# EAGLE board 005743-001 (EAGLE 6.6.0)
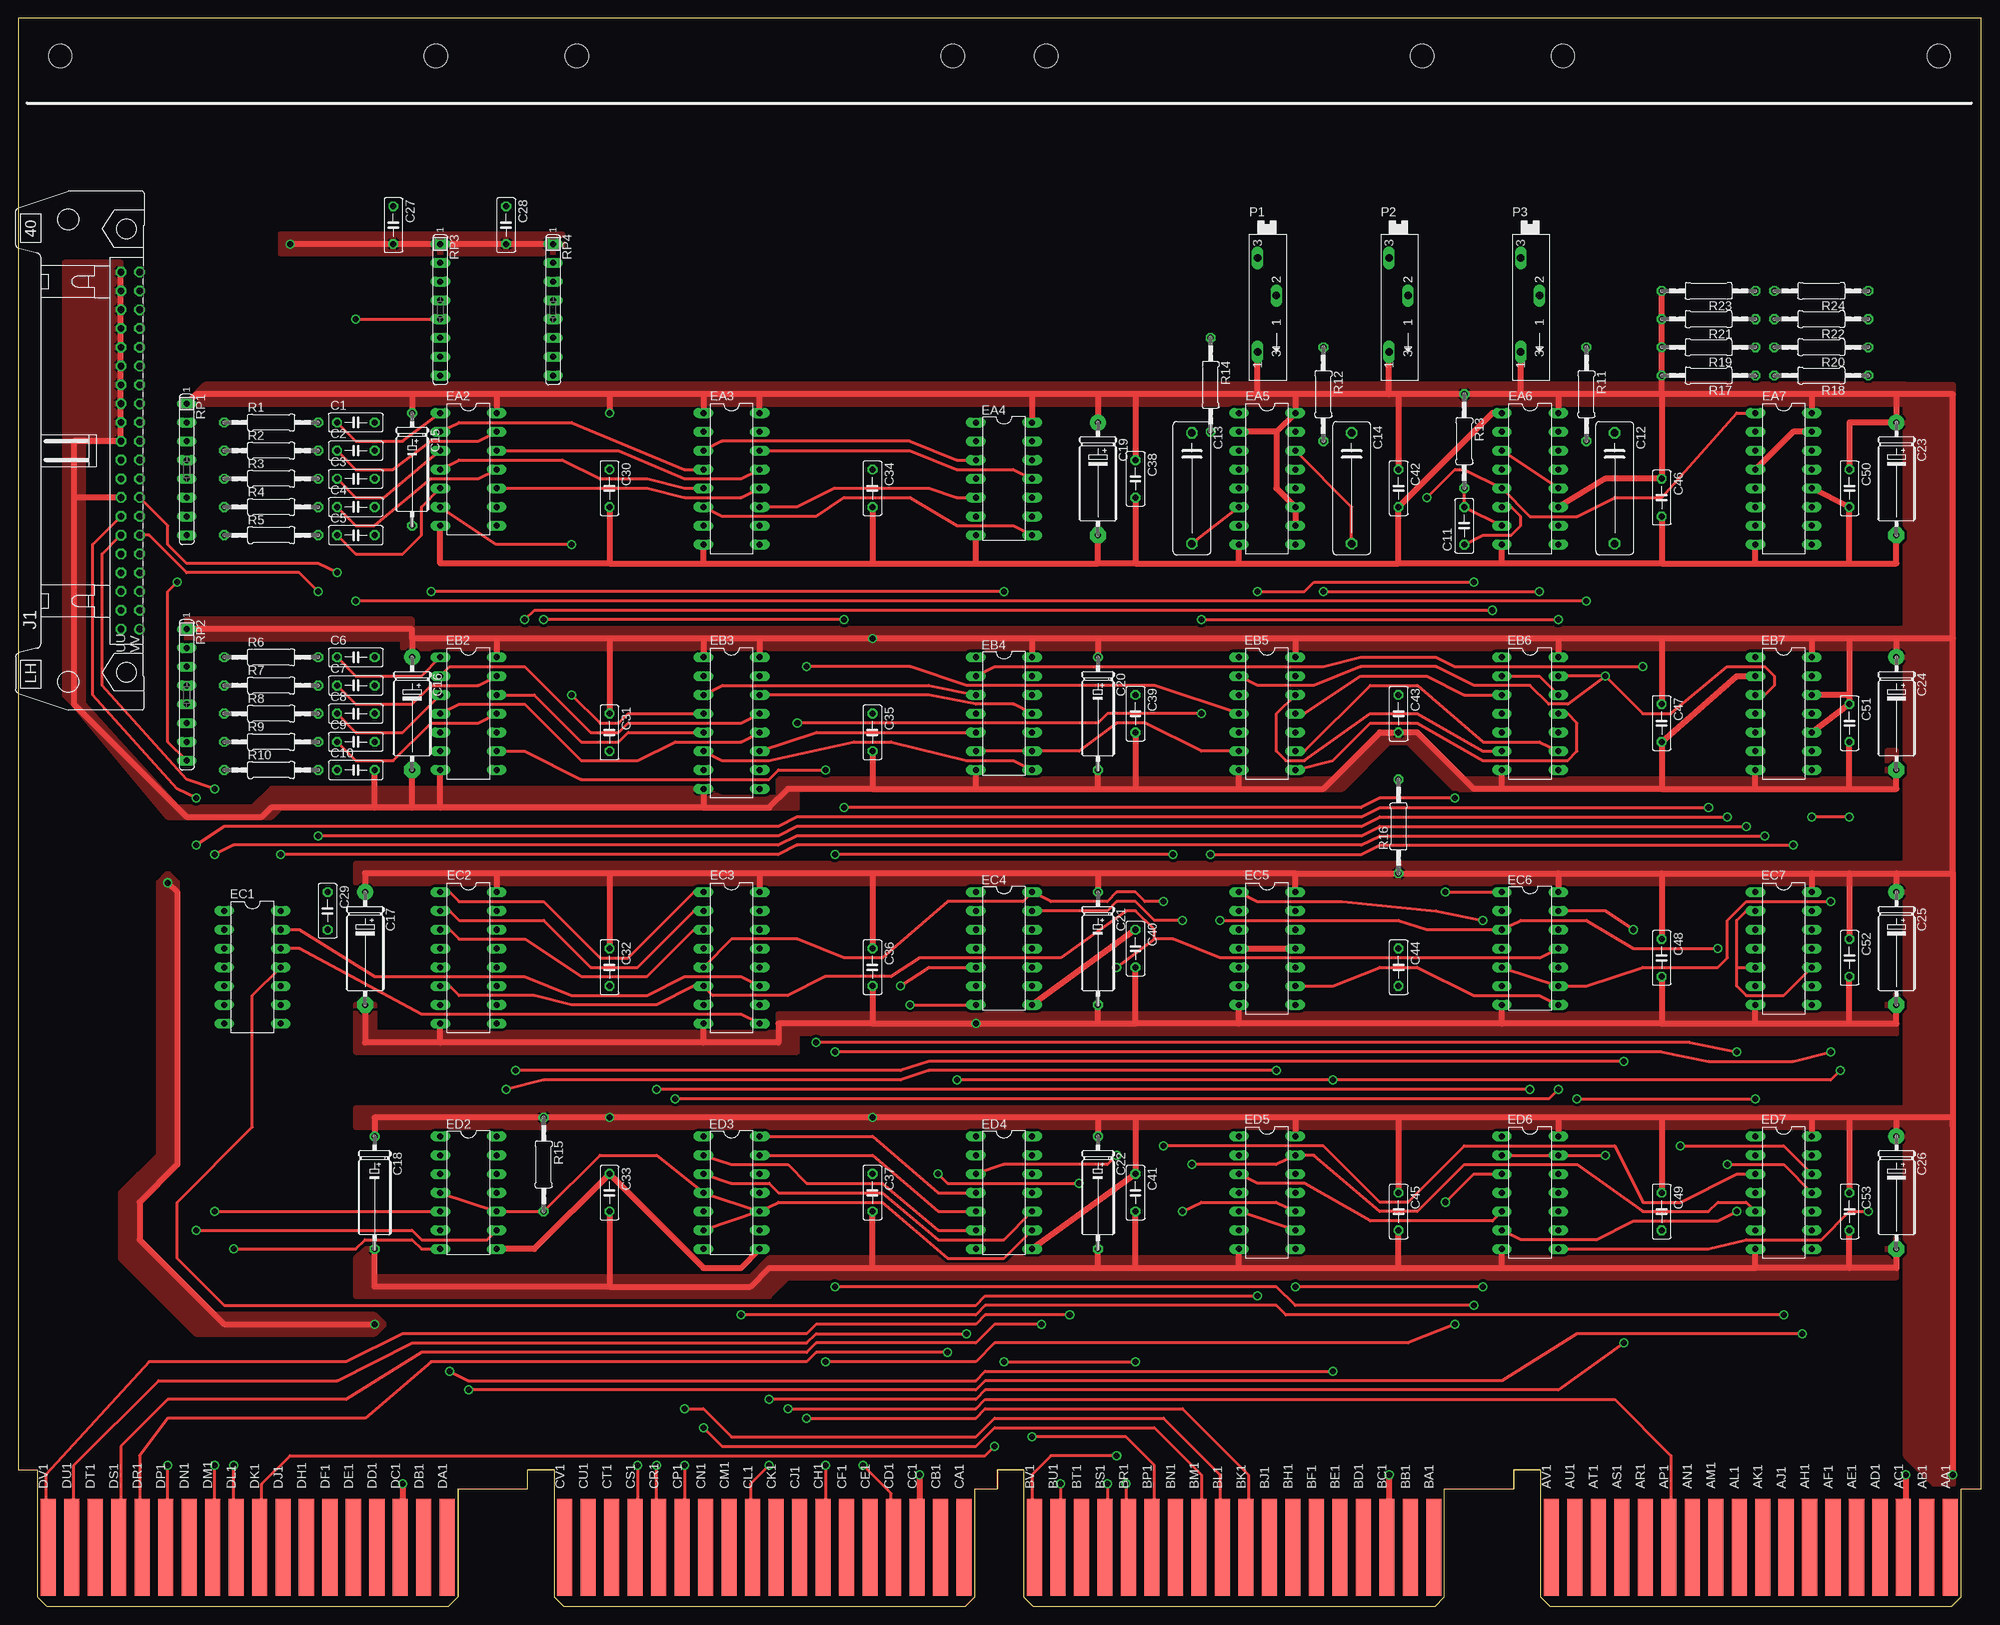
[diagram p2: board, top side]
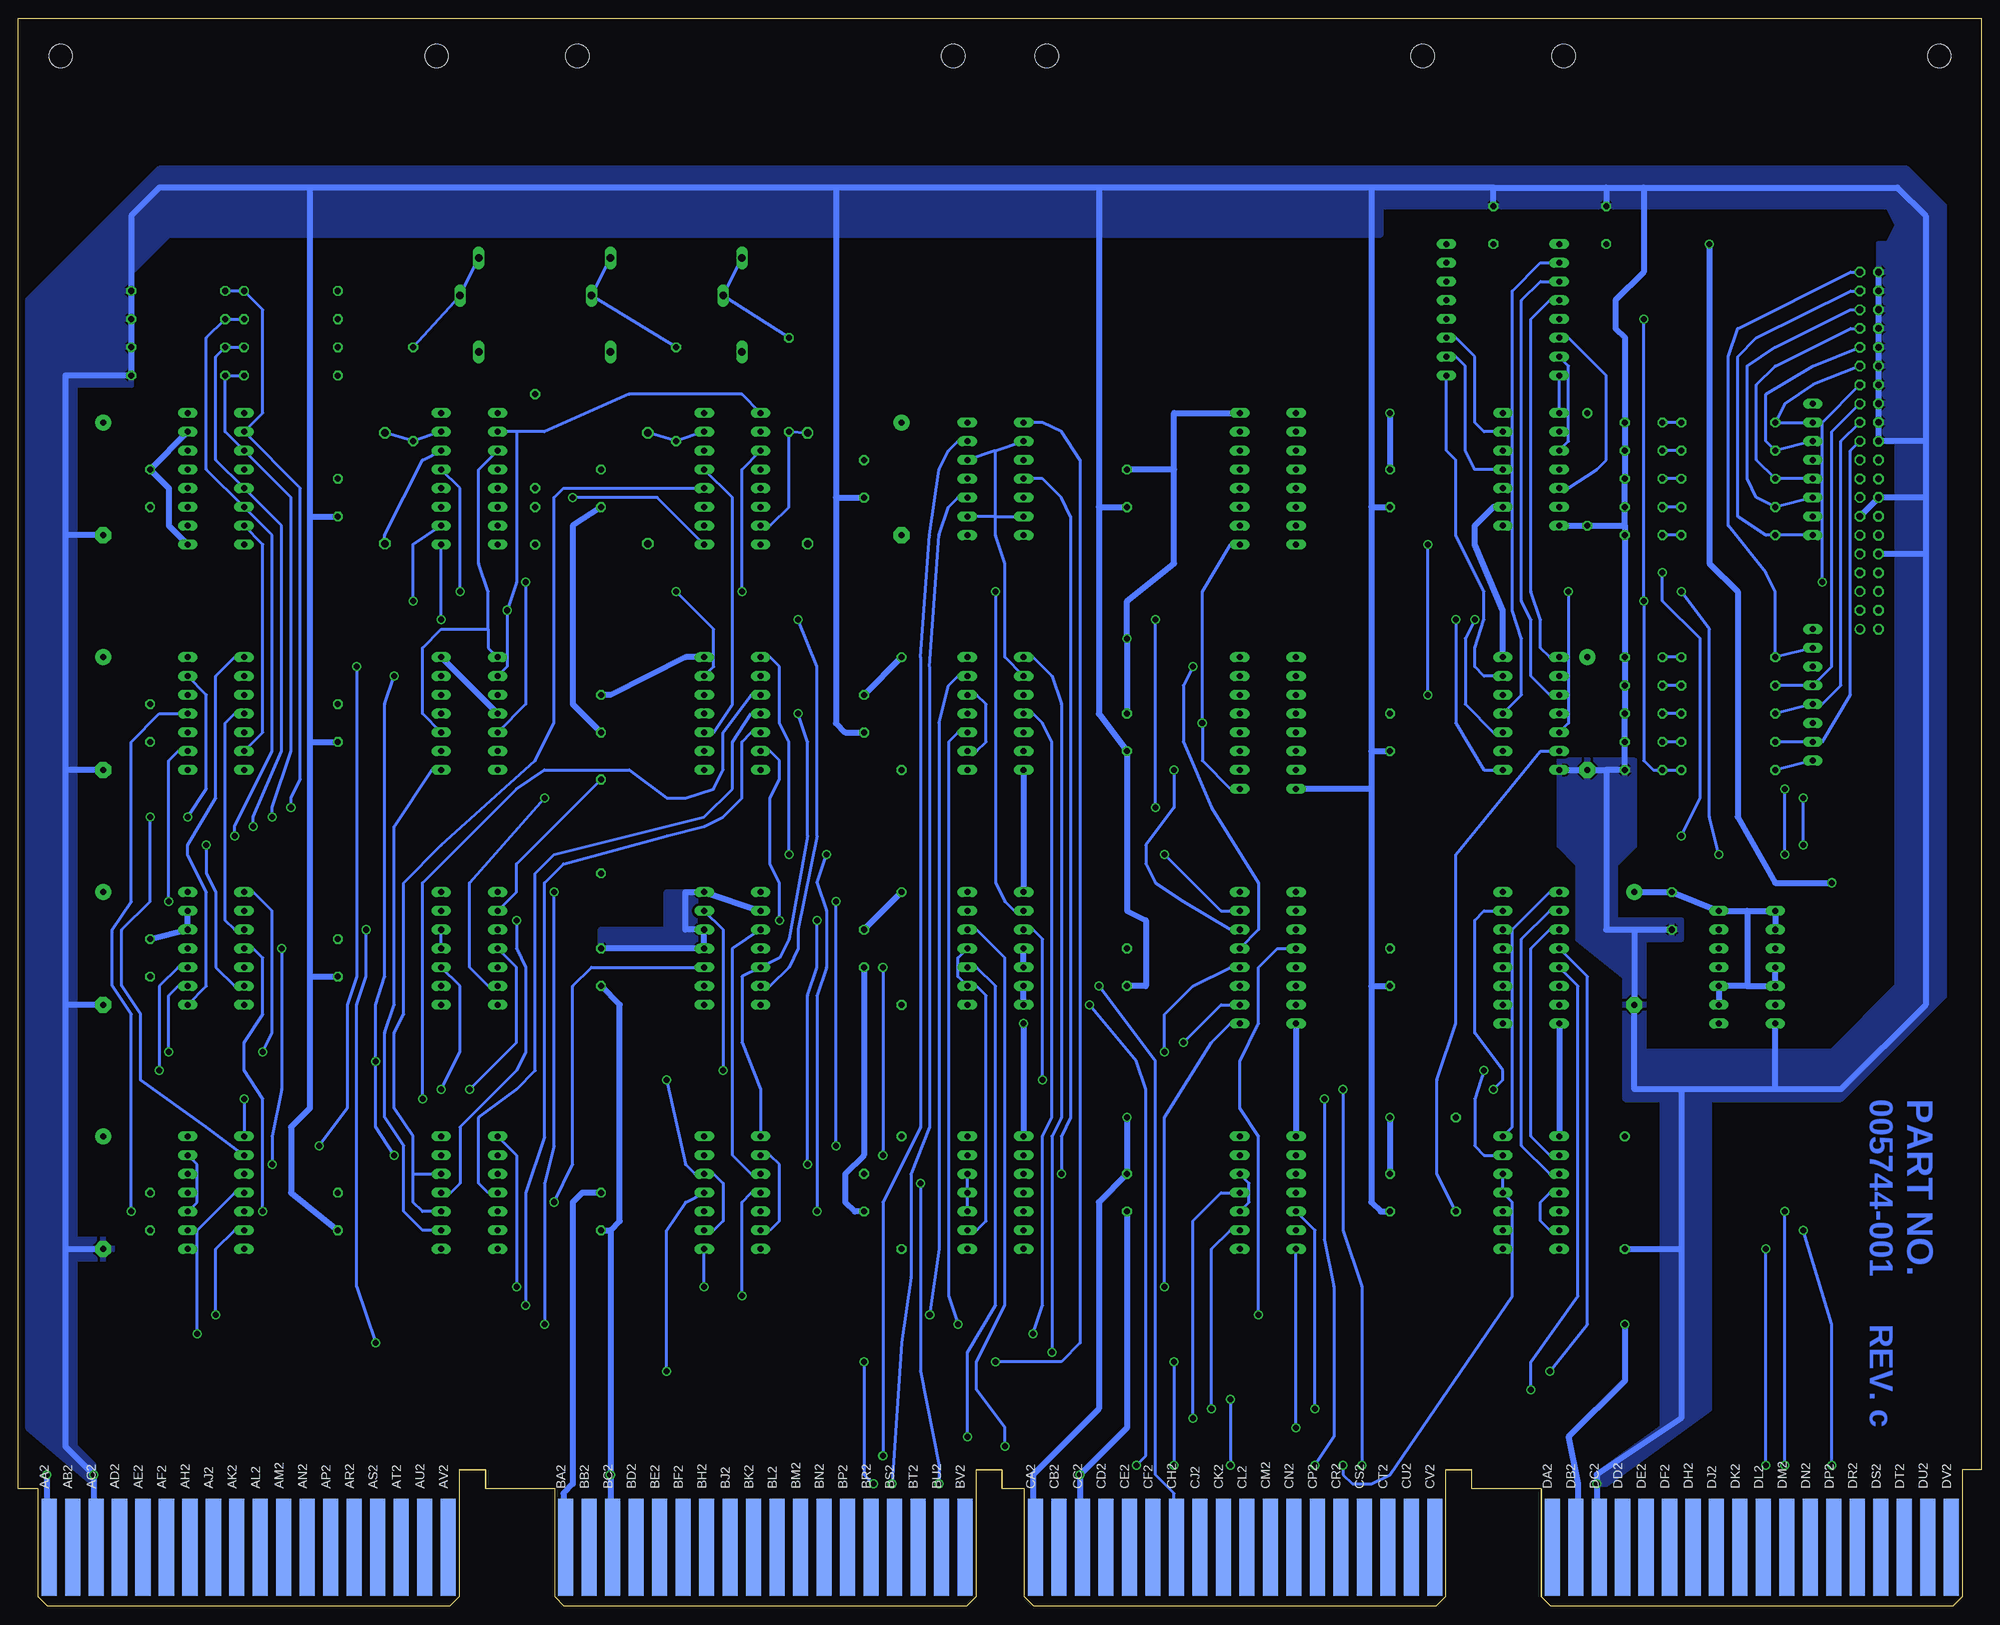
[diagram p3: board, bottom side, seen from below]

Size 265.3 x 214.63 mm. Coordinates in mm from the lower left corner, seen from the top.
Copper layers (1+16): Top 0.035mm / dielectric 1.5mm / Bottom 0.035mm
Design rules "16mils": minimum track width 16mil, minimum drill 32mil, track to track 15mil, track to pad 10mil, pad to pad 10mil, via to via 10mil, smd to smd 10mil, copper to edge 13mil, drill to drill 10mil, minimum pad ring 10mil, minimum via ring 8mil, stop-mask expansion 0mil, vias tented up to drill 0mil, thermal gap 10mil
Net classes: 1 supply: width 0.813 mm

## Footprints (pad centres in the part's own frame; a part is rotated, then mirrored left to right if it is on the bottom)
C050-025X075 = drill 0.813 octagon: 1 -2.54,0; 2 2.54,0
C150-054X183 = drill 1.016 octagon: 1 -7.493,0; 2 7.493,0
E15-5 = drill 0.813: + -7.62,0 | drill 0.813 octagon: - 7.62,0
E15-5' = drill 0.813 pad 2.159: + -7.62,0 | drill 0.813 pad 2.159 octagon: - 7.62,0
DIL14 = drill 0.813 long: 1 -7.62,-3.81; 2 -5.08,-3.81; 3 -2.54,-3.81; 4 0,-3.81; 5 2.54,-3.81; 6 5.08,-3.81; 7 7.62,-3.81; 8 7.62,3.81; 9 5.08,3.81; 10 2.54,3.81; 11 0,3.81; 12 -2.54,3.81; 13 -5.08,3.81; 14 -7.62,3.81
DIL16 = drill 0.813 long: 1 -8.89,-3.81; 2 -6.35,-3.81; 3 -3.81,-3.81; 4 -1.27,-3.81; 5 1.27,-3.81; 6 3.81,-3.81; 7 6.35,-3.81; 8 8.89,-3.81; 9 8.89,3.81; 10 6.35,3.81; 11 3.81,3.81; 12 1.27,3.81; 13 -1.27,3.81; 14 -3.81,3.81; 15 -6.35,3.81; 16 -8.89,3.81
DEC40PINH = drill 0.914 octagon: A 24.13,1.27; AA -3.81,1.27; B 24.13,-1.27; BB -3.81,-1.27; C 21.59,1.27; CC -6.35,1.27; D 21.59,-1.27; DD -6.35,-1.27; E 19.05,1.27; EE -8.89,1.27; F 19.05,-1.27; FF -8.89,-1.27; H 16.51,1.27; HH -11.43,1.27; J 16.51,-1.27; JJ -11.43,-1.27; K 13.97,1.27; KK -13.97,1.27; L 13.97,-1.27; LL -13.97,-1.27; M 11.43,1.27; MM -16.51,1.27; N 11.43,-1.27; NN -16.51,-1.27; P 8.89,1.27; PP -19.05,1.27; R 8.89,-1.27; RR -19.05,-1.27; S 6.35,1.27; SS -21.59,1.27; T 6.35,-1.27; TT -21.59,-1.27; U 3.81,1.27; UU -24.13,1.27; V 3.81,-1.27; W 1.27,1.27; X 1.27,-1.27; Y -1.27,1.27; Z -1.27,-1.27 | drill 0.914: VV -24.13,-1.27
SP19L = drill 1.016 long: A 5.715,-1.27; E -6.985,-1.27; S -1.905,1.27
0207/12 = drill 0.813 octagon: 1 -6.35,0; 2 6.35,0
SIL8 = drill 0.813 long: 1 -8.89,0; 2 -6.35,0; 3 -3.81,0; 4 -1.27,0; 5 1.27,0; 6 3.81,0; 7 6.35,0; 8 8.89,0
OMNIBUS = hole 3.175: 208.915,209.55; 259.715,209.55; 189.865,209.55; 139.065,209.55; 75.616,209.55; 126.416,209.55; 56.566,209.55; 5.766,209.55
EDGE-CON8 = smd 2.032 x 13.106: AA1 261.303,7.938; AB1 258.127,7.938; AC1 254.952,7.938; AD1 251.778,7.938; AE1 248.602,7.938; AF1 245.428,7.938; AH1 242.252,7.938; AJ1 239.077,7.938; AK1 235.903,7.938; AL1 232.727,7.938; AM1 229.553,7.938; AN1 226.377,7.938; AP1 223.202,7.938; AR1 220.028,7.938; AS1 216.852,7.938; AT1 213.678,7.938; AU1 210.502,7.938; AV1 207.327,7.938; BA1 191.452,7.938; BB1 188.278,7.938; BC1 185.102,7.938; BD1 181.928,7.938; BE1 178.752,7.938; BF1 175.577,7.938; BH1 172.403,7.938; BJ1 169.227,7.938; BK1 166.053,7.938; BL1 162.877,7.938; BM1 159.702,7.938; BN1 156.528,7.938; BP1 153.352,7.938; BR1 150.178,7.938; BS1 147.002,7.938; BT1 143.827,7.938; BU1 140.653,7.938; BV1 137.477,7.938; CA1 127.953,7.938; CB1 124.778,7.938; CC1 121.603,7.938; CD1 118.427,7.938; CE1 115.252,7.938; CF1 112.078,7.938; CH1 108.903,7.938; CJ1 105.728,7.938; CK1 102.552,7.938; CL1 99.377,7.938; CM1 96.203,7.938; CN1 93.028,7.938; CP1 89.853,7.938; CR1 86.677,7.938; CS1 83.502,7.938; CT1 80.328,7.938; CU1 77.153,7.938; CV1 73.978,7.938; DA1 58.102,7.938; DB1 54.928,7.938; DC1 51.752,7.938; DD1 48.578,7.938; DE1 45.403,7.938; DF1 42.227,7.938; DH1 39.053,7.938; DJ1 35.877,7.938; DK1 32.703,7.938; DL1 29.527,7.938; DM1 26.352,7.938; DN1 23.177,7.938; DP1 20.003,7.938; DR1 16.828,7.938; DS1 13.652,7.938; DT1 10.477,7.938; DU1 7.303,7.938; DV1 4.128,7.938 | smd 2.032 x 13.106 bottom: AA2 261.303,7.938; AB2 258.127,7.938; AC2 254.952,7.938; AD2 251.778,7.938; AE2 248.602,7.938; AF2 245.428,7.938; AH2 242.252,7.938; AJ2 239.077,7.938; AK2 235.903,7.938; AL2 232.727,7.938; AM2 229.553,7.938; AN2 226.377,7.938; AP2 223.202,7.938; AR2 220.028,7.938; AS2 216.852,7.938; AT2 213.678,7.938; AU2 210.502,7.938; AV2 207.327,7.938; BA2 191.452,7.938; BB2 188.278,7.938; BC2 185.102,7.938; BD2 181.928,7.938; BE2 178.752,7.938; BF2 175.577,7.938; BH2 172.403,7.938; BJ2 169.227,7.938; BK2 166.053,7.938; BL2 162.877,7.938; BM2 159.702,7.938; BN2 156.528,7.938; BP2 153.352,7.938; BR2 150.178,7.938; BS2 147.002,7.938; BT2 143.827,7.938; BU2 140.653,7.938; BV2 137.477,7.938; CA2 127.953,7.938; CB2 124.778,7.938; CC2 121.603,7.938; CD2 118.427,7.938; CE2 115.252,7.938; CF2 112.078,7.938; CH2 108.903,7.938; CJ2 105.728,7.938; CK2 102.552,7.938; CL2 99.377,7.938; CM2 96.203,7.938; CN2 93.028,7.938; CP2 89.853,7.938; CR2 86.677,7.938; CS2 83.502,7.938; CT2 80.328,7.938; CU2 77.153,7.938; CV2 73.978,7.938; DA2 58.102,7.938; DB2 54.928,7.938; DC2 51.752,7.938; DD2 48.578,7.938; DE2 45.403,7.938; DF2 42.227,7.938; DH2 39.053,7.938; DJ2 35.877,7.938; DK2 32.703,7.938; DL2 29.527,7.938; DM2 26.352,7.938; DN2 23.177,7.938; DP2 20.003,7.938; DR2 16.828,7.938; DS2 13.652,7.938; DT2 10.477,7.938; DU2 7.303,7.938; DV2 4.128,7.938

## Placement (x,y rotation side)
C1  .001uF  [C050-025X075]  45.59,160.02 0 top
C2  .001uF  [C050-025X075]  45.59,156.21 0 top
C3  .001uF  [C050-025X075]  45.59,152.4 0 top
C4  .001uF  [C050-025X075]  45.59,148.59 0 top
C5  .001uF  [C050-025X075]  45.59,144.78 0 top
C6  .001uF  [C050-025X075]  45.59,128.27 0 top
C7  .001uF  [C050-025X075]  45.59,124.46 0 top
C8  .001uF  [C050-025X075]  45.59,120.65 0 top
C9  .001uF  [C050-025X075]  45.59,116.84 0 top
C10  .001uF  [C050-025X075]  45.59,113.03 0 top
C11  .01uF  [C050-025X075]  195.45,146.05 90 top
C12  .1uF  [C150-054X183]  215.77,151.13 270 top
C13  .1uF  [C150-054X183]  158.62,151.13 270 top
C14  .1uF  [C150-054X183]  180.21,151.13 270 top
C15  10uF  [E15-5]  53.21,153.67 270 top
C16  10uF  [E15-5']  53.21,120.65 270 top
C17  10uF  [E15-5']  46.86,88.9 270 top
C18  10uF  [E15-5]  48.13,55.88 270 top
C19  10uF  [E15-5']  145.92,152.4 270 top
C20  10uF  [E15-5]  145.92,120.65 270 top
C21  10uF  [E15-5]  145.92,88.9 270 top
C22  10uF  [E15-5]  145.92,55.88 270 top
C23  10uF  [E15-5']  253.87,152.4 270 top
C24  10uF  [E15-5']  253.87,120.65 270 top
C25  10uF  [E15-5']  253.87,88.9 270 top
C26  10uF  [E15-5']  253.87,55.88 270 top
C27  .01uF  [C050-025X075]  50.67,186.69 270 top
C28  .01uF  [C050-025X075]  65.91,186.69 270 top
C29  .01uF  [C050-025X075]  41.78,93.98 270 top
C30  .01uF  [C050-025X075]  79.88,151.13 270 top
C31  .01uF  [C050-025X075]  79.88,118.11 270 top
C32  .01uF  [C050-025X075]  79.88,86.36 270 top
C33  .01uF  [C050-025X075]  79.88,55.88 270 top
C34  .01uF  [C050-025X075]  115.44,151.13 270 top
C35  .01uF  [C050-025X075]  115.44,118.11 270 top
C36  .01uF  [C050-025X075]  115.44,86.36 270 top
C37  .01uF  [C050-025X075]  115.44,55.88 270 top
C38  .01uF  [C050-025X075]  151,152.4 270 top
C39  .01uF  [C050-025X075]  151,120.65 270 top
C40  .01uF  [C050-025X075]  151,88.9 270 top
C41  .01uF  [C050-025X075]  151,55.88 270 top
C42  .01uF  [C050-025X075]  186.56,151.13 270 top
C43  .01uF  [C050-025X075]  186.56,120.65 270 top
C44  .01uF  [C050-025X075]  186.56,86.36 270 top
C45  .01uF  [C050-025X075]  186.56,53.34 270 top
C46  .01uF  [C050-025X075]  222.12,149.86 270 top
C47  .01uF  [C050-025X075]  222.12,119.38 270 top
C48  .01uF  [C050-025X075]  222.12,87.63 270 top
C49  .01uF  [C050-025X075]  222.12,53.34 270 top
C50  .01uF  [C050-025X075]  247.52,151.13 270 top
C51  .01uF  [C050-025X075]  247.52,119.38 270 top
C52  .01uF  [C050-025X075]  247.52,87.63 270 top
C53  .01uF  [C050-025X075]  247.52,53.34 270 top
EA2  74LS14N  [DIL14]  60.83,153.67 270 top
EA3  74LS175N  [DIL16]  96.39,152.4 270 top
EA4  N8881N  [DIL14]  133.22,152.4 270 top
EA5  74LS221N  [DIL16]  168.78,152.4 270 top
EA6  74LS221N  [DIL16]  204.34,152.4 270 top
EA7  AM26LS31  [DIL16]  238.63,152.4 270 top
EB2  74LS14N  [DIL14]  60.83,120.65 270 top
EB3  74LS175N  [DIL16]  96.39,119.38 270 top
EB4  N8881N  [DIL14]  133.22,120.65 270 top
EB5  74LS00N  [DIL14]  168.78,120.65 270 top
EB6  74LS74N  [DIL14]  204.34,120.65 270 top
EB7  74LS74N  [DIL14]  238.63,120.65 270 top
EC1  74LS08N  [DIL14]  31.62,86.36 270 top
EC2  74LS138N  [DIL16]  60.83,87.63 270 top
EC3  74LS138N  [DIL16]  96.39,87.63 270 top
EC4  SP380N  [DIL14]  133.22,88.9 270 top
EC5  74LS74N  [DIL14]  168.78,88.9 270 top
EC6  N8881N  [DIL14]  204.34,88.9 270 top
EC7  74LS32N  [DIL14]  238.63,88.9 270 top
ED2  SP380N  [DIL14]  60.83,55.88 270 top
ED3  SP380N  [DIL14]  96.39,55.88 270 top
ED4  SP314N  [DIL14]  133.22,55.88 270 top
ED5  74LS32N  [DIL14]  168.78,55.88 270 top
ED6  74LS08N  [DIL14]  204.34,55.88 270 top
ED7  74LS04N  [DIL14]  238.63,55.88 270 top
J1  DEC40PINSH  [DEC40PINH]  15.11,156.21 90 top
P1  50K  [SP19L]  168.78,175.26 270 top
P2  50K  [SP19L]  186.56,175.26 270 top
P3  50K  [SP19L]  204.34,175.26 270 top
R1  100  [0207/12]  34.16,160.02 0 top
R2  100  [0207/12]  34.16,156.21 0 top
R3  100  [0207/12]  34.16,152.4 0 top
R4  100  [0207/12]  34.16,148.59 0 top
R5  100  [0207/12]  34.16,144.78 0 top
R6  100  [0207/12]  34.16,128.27 0 top
R7  100  [0207/12]  34.16,124.46 0 top
R8  100  [0207/12]  34.16,120.65 0 top
R9  100  [0207/12]  34.16,116.84 0 top
R10  100  [0207/12]  34.16,113.03 0 top
R11  4.7K  [0207/12]  211.96,163.83 270 top
R12  4.7K  [0207/12]  176.4,163.83 270 top
R13  47K  [0207/12]  195.45,157.48 270 top
R14  82K  [0207/12]  161.16,165.1 270 top
R15  1K  [0207/12]  70.99,59.69 270 top
R16  4.7K  [0207/12]  186.56,105.41 90 top
R17  NC  [0207/12]  228.47,166.37 180 top
R18  NC  [0207/12]  243.71,166.37 180 top
R19  NC  [0207/12]  228.47,170.18 180 top
R20  NC  [0207/12]  243.71,170.18 180 top
R21  NC  [0207/12]  228.47,173.99 180 top
R22  NC  [0207/12]  243.71,173.99 180 top
R23  NC  [0207/12]  228.47,177.8 180 top
R24  NC  [0207/12]  243.71,177.8 180 top
RP1  4.7K  [SIL8]  22.73,153.67 270 top
RP2  4.7K  [SIL8]  22.73,123.19 270 top
RP3  10K  [SIL8]  57.02,175.26 270 top
RP4  10K  [SIL8]  72.26,175.26 270 top
U$1  OUTLINE-OMNIBUS  [OMNIBUS]  -0.13,0 0 top
U$2  [EDGE-CON8]  -0.13,0 0 top

## Tracks (layer width: path | path; a pad name or v marks a point on that pad's centre or on a via)
!C1  (via drill 0.81)
  Top 0.406: U$2.CH1 109.09,8.26 v109.09,19.05 | v109.09,33.02 129.41,33.02 131.95,35.56 187.83,35.56 v194.18,38.1 | v192.91,96.52 EC6.1
  Bottom 0.406: v109.09,33.02 v109.09,19.05 | v194.18,38.1 194.18,57.15 192.91,62.23 v192.91,96.52
!DATA4  (via drill 0.81)
  Top 0.406: U$2.BR1 149.73,8.26 v149.73,16.51 | v133.22,33.02 v151,33.02
  Bottom 0.406: v149.73,16.51 151,17.78 v151,33.02 | v133.22,33.02 124.33,33.02 121.79,35.56 121.79,154.94 124.33,158.75 126.87,160.02 EA4.1
!DATA5  (via drill 0.81)
  Top 0.406: U$2.BS1 147.19,8.26 v147.19,16.51
  Bottom 0.406: v147.19,16.51 145.92,35.56 144.65,44.45 144.65,58.42 142.11,64.77 142.11,127 140.84,144.78 139.57,148.59 138.3,149.86 EA4.10
!DATA6  (via drill 0.81)
  Top 0.406: U$2.BU1 140.84,8.26 v140.84,16.51 | v124.33,58.42 125.6,57.15 v143.38,57.15
  Bottom 0.406: v140.84,16.51 140.84,19.05 143.38,31.75 v143.38,57.15 | v124.33,58.42 124.33,63.5 123.06,66.04 123.06,147.32 124.33,149.86 126.87,152.4 EA4.4
!DATA7  (via drill 0.81)
  Top 0.406: U$2.BV1 137.03,8.26 137.03,17.78 139.57,20.32 v148.46,20.32
  Bottom 0.406: v148.46,20.32 148.46,54.61 143.38,64.77 143.38,128.27 142.11,144.78 140.84,153.67 139.57,156.21 138.3,157.48 EA4.13
!DATA8  (via drill 0.81)
  Top 0.406: U$2.DR1 16.38,8.26 16.38,20.32 20.19,25.4 46.86,25.4 55.75,33.02 106.55,33.02 107.82,34.29 v125.6,34.29
  Bottom 0.406: v125.6,34.29 125.6,63.5 124.33,66.04 124.33,121.92 125.6,125.73 128.14,128.27 EB4.1
!DATA9  (via drill 0.81)
  Top 0.406: U$2.DS1 13.84,8.26 13.84,21.59 20.19,27.94 44.32,27.94 54.48,34.29 106.55,34.29 107.82,35.56 129.41,35.56 131.95,38.1 v138.3,38.1
  Bottom 0.406: v138.3,38.1 139.57,41.91 139.57,116.84 138.3,118.11 EB4.10
!DATA10  (via drill 0.81)
  Top 0.406: U$2.DU1 7.49,8.26 7.49,19.05 18.92,30.48 43.05,30.48 53.21,35.56 106.55,35.56 107.82,36.83 v128.14,36.83
  Bottom 0.406: v128.14,36.83 126.87,40.64 126.87,63.5 125.6,66.04 125.6,116.84 126.87,119.38 128.14,120.65 EB4.4
!DATA11  (via drill 0.81)
  Top 0.406: U$2.DV1 3.68,8.26 3.68,17.78 17.65,33.02 44.32,33.02 51.94,36.83 106.55,36.83 107.82,38.1 129.41,38.1 130.68,39.37 v142.11,39.37
  Bottom 0.406: v142.11,39.37 140.84,48.26 140.84,119.38 139.57,124.46 138.3,125.73 EB4.13
!FETCH
  Top 0.406: ED6.5 199.26,52.07 182.75,52.07 173.86,57.15 167.51,57.15 ED5.3
  Bottom 0.406: ED5.3 166.24,58.42 168.78,60.96 168.78,88.9 EC5.3
!INITIALIZE  (via drill 0.81)
  Top 0.406: v67.18,72.39 119.25,72.39 123.06,73.66 v217.04,73.66 | EB5.2 167.51,124.46 175.13,124.46 181.48,127 191.64,127 196.72,124.46 204.34,124.46 206.88,121.92 209.42,121.92 v214.5,125.73 | v214.5,125.73 EB6.13 | v214.5,125.73 219.58,120.65 223.39,120.65 231.01,127 236.09,127 237.36,125.73 237.36,124.46 236.09,123.19 EB7.3 | v214.5,60.96 ED6.13 ED6.2
  Bottom 0.406: ED2.13 67.18,60.96 68.45,62.23 68.45,68.58 v67.18,72.39 | v214.5,60.96 217.04,64.77 v217.04,73.66 217.04,81.28 215.77,85.09 215.77,121.92 v214.5,125.73
!INT_RQST  (via drill 0.81)
  Top 0.406: U$2.CP1 90.04,8.26 v90.04,19.05 | v88.77,68.58 206.88,68.58 v208.15,69.85
  Bottom 0.406: v90.04,19.05 87.5,22.86 87.5,43.18 88.77,49.53 v88.77,68.58 | v208.15,69.85 205.61,74.93 205.61,83.82 EC6.10
!INTERNAL_IO  (via drill 0.81)
  Top 0.406: U$2.CL1 98.93,8.26 98.93,16.51 v101.47,19.05 | v101.47,27.94 129.41,27.94 130.68,29.21 208.15,29.21 v217.04,35.56 | EC6.13 214.5,93.98 v218.31,91.44
  Bottom 0.406: v101.47,27.94 v101.47,19.05 | v218.31,91.44 218.31,85.09 219.58,81.28 219.58,43.18 v217.04,35.56
!IO_PAUSE  (via drill 0.81)
  Top 0.406: U$2.CD1 117.98,8.26 117.98,15.24 v114.17,19.05 | v120.52,81.28 EC4.7
  Bottom 0.406: v114.17,19.05 112.9,20.32 112.9,69.85 114.17,73.66 v120.52,81.28
  Bottom 0.813: EC4.7 EC4.6
!IOT010  (via drill 0.81)
  Top 0.406: v157.35,53.34 159.89,54.61 170.05,54.61 ED5.10 | v156.08,101.6 v110.36,101.6
  Bottom 0.406: EC3.15 102.74,93.98 v110.36,101.6 | v157.35,53.34 157.35,82.55 156.08,86.36 156.08,93.98 157.35,97.79 v156.08,101.6
!IOT011  (via drill 0.81)
  Top 0.406: EB2.9 68.45,115.57 76.07,111.76 101.47,111.76 102.74,113.03 v109.09,113.03
  Bottom 0.406: EC3.14 101.47,91.44 107.82,95.25 111.63,97.79 112.9,100.33 112.9,102.87 109.09,107.95 v109.09,113.03
!IOT012  (via drill 0.81)
  Top 0.406: v106.55,127 120.52,127 128.14,124.46 153.54,124.46 EB5.4
  Bottom 0.406: EC3.13 97.66,91.44 97.66,97.79 104.01,107.95 107.82,116.84 107.82,124.46 v106.55,127 | ED6.4 201.8,55.88 203.07,57.15 203.07,66.04 197.99,69.85 195.45,72.39 195.45,99.06 192.91,101.6 172.59,106.68 168.78,110.49 168.78,116.84 166.24,120.65 EB5.4
!IOT013  (via drill 0.81)
  Top 0.406: v244.98,74.93 239.9,73.66 228.47,73.66 222.12,74.93 v110.36,74.93
  Bottom 0.406: EC3.12 101.47,86.36 106.55,83.82 110.36,80.01 v110.36,74.93 | EC7.9 243.71,83.82 244.98,82.55 v244.98,74.93
!IOT014
  Top 0.406: EC1.13 37.97,91.44 48.13,85.09 68.45,85.09 74.8,82.55 84.96,82.55 90.04,85.09 97.66,85.09 EC3.11
!IOT015  (via drill 0.81)
  Top 0.406: v232.28,74.93 225.93,76.2 v107.82,76.2
  Bottom 0.406: EC3.10 102.74,81.28 v107.82,76.2 | v232.28,74.93 231.01,77.47 231.01,93.98 233.55,96.52 EC7.1
!IOT016  (via drill 0.81)
  Top 0.406: v110.36,43.18 170.05,43.18 172.59,40.64 v196.72,40.64 | EC1.12 37.97,88.9 54.48,80.01 97.66,80.01 EC3.9
  Bottom 0.406: v110.36,43.18 110.36,66.04 104.01,76.2 101.47,78.74 EC3.9 | EB5.5 166.24,118.11 167.51,116.84 167.51,109.22 170.05,106.68 172.59,105.41 177.67,104.14 191.64,100.33 194.18,97.79 194.18,63.5 196.72,55.88 v196.72,40.64
!IOT020  (via drill 0.81)
  Top 0.406: v65.91,69.85 70.99,71.12 119.25,71.12 123.06,72.39 v170.05,72.39
  Bottom 0.406: v65.91,69.85 64.64,71.12 64.64,72.39 68.45,77.47 68.45,92.71 67.18,93.98 EC2.15 | EC5.13 170.05,91.44 v170.05,72.39
!MD03  (via drill 0.81)
  Top 0.406: U$2.AP1 223.39,8.26 223.39,20.32 215.77,27.94 130.68,27.94 129.41,26.67 v104.01,26.67
  Bottom 0.406: ED3.9 101.47,50.8 104.01,48.26 v104.01,26.67
!MD04  (via drill 0.81)
  Top 0.406: U$2.BK1 166.24,8.26 166.24,17.78 157.35,26.67 130.68,26.67 129.41,25.4 v106.55,25.4
  Bottom 0.406: v106.55,25.4 106.55,52.07 102.74,55.88 ED3.11
!MD05  (via drill 0.81)
  Top 0.406: U$2.BL1 162.43,8.26 162.43,17.78 154.81,25.4 131.95,25.4 129.41,22.86 96.39,22.86 92.58,26.67 v90.04,26.67
  Bottom 0.406: ED3.5 90.04,50.8 v90.04,26.67
!MD06  (via drill 0.81)
  Top 0.406: U$2.BM1 159.89,8.26 159.89,17.78 153.54,24.13 131.95,24.13 129.41,21.59 95.12,21.59 v92.58,24.13
  Bottom 0.406: v92.58,24.13 ED3.7
!MD07  (via drill 0.81)
  Top 0.406: v137.03,22.86 149.73,22.86 153.54,19.05 153.54,8.26 U$2.BP1
  Bottom 0.406: v137.03,22.86 137.03,34.29 133.22,40.64 133.22,83.82 135.76,86.36 EC4.10
!MD08  (via drill 0.81)
  Top 0.406: U$2.DK1 32.89,8.26 32.89,16.51 36.7,20.32 130.68,20.32 v131.95,21.59
  Bottom 0.406: v131.95,21.59 131.95,24.13 135.76,29.21 135.76,33.02 131.95,40.64 131.95,87.63 135.76,91.44 EC4.12
!MD09  (via drill 0.81)
  Top 0.406: U$2.DL1 29.08,8.26 v29.08,19.05 | v29.08,48.26 45.59,48.26 46.86,49.53 53.21,49.53 54.48,48.26 ED2.7
  Bottom 0.406: v29.08,19.05 v29.08,48.26
!MD10  (via drill 0.81)
  Top 0.406: U$2.DM1 26.54,8.26 v26.54,19.05 | v26.54,53.34 ED2.5
  Bottom 0.406: v26.54,19.05 v26.54,53.34
!MD11  (via drill 0.81)
  Top 0.406: U$2.DP1 20.19,8.26 v20.19,19.05 | v24,50.8 53.21,50.8 54.48,49.53 63.37,49.53 ED2.9
  Bottom 0.406: v20.19,19.05 20.19,38.1 v24,50.8
!PTSTROBE  (via drill 0.81)
  Top 0.406: v68.45,133.35 69.72,134.62 v199.26,134.62 | EB6.2 205.61,125.73 EB6.12
  Bottom 0.406: EB2.10 65.91,118.11 69.72,121.92 69.72,130.81 v68.45,133.35 | EB6.2 199.26,127 v199.26,134.62 197.99,138.43 197.99,158.75 | 197.99,158.75 EA6.2 | EA5.1 167.51,163.83 182.75,163.83 194.18,158.75 197.99,158.75
!SKIP  (via drill 0.81)
  Top 0.406: U$2.CS1 83.69,8.26 v83.69,19.05 | v204.34,69.85 v86.23,69.85
  Bottom 0.406: v83.69,19.05 83.69,43.18 86.23,50.8 v86.23,69.85 | v204.34,69.85 197.99,76.2 197.99,86.36 EC6.4
!TP3  (via drill 0.81)
  Top 0.406: ED5.9 ED5.5 | v246.25,72.39 244.98,71.12 v177.67,71.12 v126.87,71.12 | EC7.10 238.63,82.55 233.55,82.55 232.28,83.82 232.28,86.36 | 232.28,86.36 EC7.5 | 232.28,86.36 232.28,92.71 233.55,93.98 EC7.2
  Bottom 0.406: ED5.9 171.32,50.8 170.05,52.07 170.05,57.15 171.32,58.42 ED5.12 173.86,58.42 175.13,59.69 v177.67,71.12 | EC7.10 243.71,86.36 246.25,83.82 v246.25,72.39 | EC4.3 128.14,91.44 126.87,90.17 v126.87,71.12
!TP3010  (via drill 0.81)
  Top 0.406: v197.99,43.18 v172.59,43.18
  Bottom 0.406: v197.99,43.18 197.99,60.96 ED6.1 | v172.59,43.18 ED5.8
!TP3013
  Bottom 0.406: EB7.1 236.09,128.27 238.63,125.73 238.63,109.22 242.44,102.87 242.44,101.6 239.9,96.52 239.9,83.82 EC7.8
!TP3015
  Bottom 0.406: EB7.4 236.09,120.65 237.36,119.38 237.36,92.71 236.09,91.44 EC7.3
-15V  (via drill 0.81)
  Top 0.813: RP4.1 C28.2 RP3.1 C27.2 v36.7,184.15 | v48.13,38.1 27.81,38.1 16.38,49.53 16.38,54.61 21.46,59.69 21.46,96.52 v20.19,97.79
  Bottom 0.813: U$2.DB2 54.48,8.26 54.48,16.51 55.75,22.86 48.13,30.48 v48.13,38.1 | v20.19,97.79 27.81,97.79 32.89,106.68 32.89,137.16 36.7,140.97 v36.7,184.15
  pour Top: 49.4,38.1 48.13,39.37 26.54,39.37 16.38,49.53 16.38,54.61 21.46,59.69 21.46,97.79 20.19,99.06 18.92,97.79 18.92,60.96 13.84,55.88 13.84,46.99 24,36.83 48.13,36.83
  pour Top: 35.43,182.88 73.53,182.88 73.53,185.42 35.43,185.42
C1  (via drill 0.81)
  Top 0.406: v231.01,59.69 238.63,59.69 ED7.11 | EB4.6 EB4.9 143.38,115.57 148.46,119.38 152.27,119.38 159.89,115.57 EB5.6 | v162.43,92.71 186.56,92.71 190.37,91.44 EC6.3 203.07,92.71 211.96,92.71 218.31,88.9 v229.74,88.9
  Bottom 0.406: v231.01,59.69 231.01,63.5 229.74,69.85 v229.74,88.9 | EB4.9 135.76,115.57 134.49,116.84 134.49,121.92 135.76,123.19 EB4.12 | EB5.6 163.7,115.57 162.43,114.3 162.43,111.76 163.7,109.22 163.7,100.33 162.43,97.79 v162.43,92.71
GND  (via drill 0.81)
  Top 0.813: U$2.DC2 51.94,8.26 v51.94,16.51 | U$2.AC1 255.14,8.26 v255.14,17.78 | C18.- 48.13,43.18 79.88,43.18 | 79.88,43.18 98.93,43.18 101.47,45.72 115.44,45.72 | 115.44,45.72 145.92,45.72 | 145.92,45.72 C22.- | 145.92,45.72 151,45.72 | 151,45.72 164.97,45.72 | 164.97,45.72 186.56,45.72 | 186.56,45.72 200.53,45.72 | 200.53,45.72 234.82,45.72 | 247.52,45.72 234.82,45.72 | 247.52,45.72 253.87,45.72 C26.- | 247.52,45.72 C53.2 | 234.82,45.72 ED7.7 | 200.53,45.72 ED6.7 | 164.97,45.72 ED5.7 | 151,45.72 C41.2 | 115.44,45.72 C37.2 | C33.2 79.88,43.18 | C17.- 46.86,76.2 57.02,76.2 | 92.58,76.2 57.02,76.2 | 115.44,78.74 102.74,78.74 102.74,76.2 92.58,76.2 | 145.92,78.74 v129.41,78.74 115.44,78.74 | 164.97,78.74 151,78.74 | 145.92,78.74 151,78.74 | 247.52,78.74 253.87,78.74 C25.- | 234.82,78.74 247.52,78.74 | 222.12,78.74 234.82,78.74 | 222.12,78.74 200.53,78.74 | 200.53,78.74 164.97,78.74 | 247.52,78.74 C52.2 | 234.82,78.74 EC7.7 | C48.2 222.12,78.74 | 200.53,78.74 EC6.7 | 164.97,78.74 EC5.7 | 145.92,78.74 C21.- | 151,78.74 C40.2 | C36.2 115.44,78.74 | 92.58,76.2 EC3.8 | 57.02,76.2 EC2.8 | 48.13,107.95 C10.2 | 53.21,107.95 48.13,107.95 | 57.02,107.95 53.21,107.95 | 57.02,107.95 EB2.7 | 53.21,107.95 C16.- | EB3.8 92.58,107.95 | 92.58,107.95 57.02,107.95 | C35.2 115.44,110.49 | 115.44,110.49 129.41,110.49 | 129.41,110.49 EB4.7 | 92.58,107.95 101.47,107.95 104.01,110.49 115.44,110.49 | 145.92,110.49 C20.- | 129.41,110.49 145.92,110.49 | C39.2 151,110.49 | 145.92,110.49 151,110.49 | 151,110.49 164.97,110.49 | 164.97,110.49 EB5.7 | 164.97,110.49 176.4,110.49 184.02,118.11 C43.2 189.1,118.11 196.72,110.49 200.53,110.49 | 200.53,110.49 EB6.7 | 222.12,110.49 200.53,110.49 | 222.12,110.49 C47.2 232.28,125.73 EB7.2
  Top 0.813: 234.82,110.49 EB7.7 | 222.12,110.49 234.82,110.49 | 247.52,110.49 C51.2 | 234.82,110.49 247.52,110.49 | 247.52,110.49 253.87,110.49 C24.- | 92.58,140.97 EA3.8 | 79.88,140.97 92.58,140.97 | 79.88,140.97 57.02,140.97 EA2.7 | C30.2 79.88,140.97 | C34.2 115.44,140.97 | 92.58,140.97 115.44,140.97 | 129.41,140.97 EA4.7 | 115.44,140.97 129.41,140.97 | 145.92,140.97 C19.- | 129.41,140.97 145.92,140.97 | 164.97,140.97 EA5.8 | 151,140.97 145.92,140.97 | 151,140.97 164.97,140.97 | 200.53,140.97 EA6.8 | 164.97,140.97 186.56,140.97 | 200.53,140.97 186.56,140.97 | C38.2 151,140.97 | 186.56,140.97 C42.2 199.26,161.29 EA6.1 | 234.82,140.97 EA7.8 | 222.12,140.97 200.53,140.97 | 222.12,140.97 234.82,140.97 | C46.2 222.12,140.97 | EA7.12 C50.2 247.52,140.97 | 234.82,140.97 247.52,140.97 | 247.52,140.97 253.87,140.97 C23.- | U$2.CC2 121.79,8.26 v121.79,17.78 | U$2.BC1 185.29,8.26 v185.29,17.78 | 186.56,45.72 C45.2 | 48.13,107.95 34.16,107.95 32.89,106.68 22.73,106.68 7.49,121.92 7.49,149.86 | J1.CC 7.49,149.86 | 7.49,149.86 7.49,157.48 J1.W J1.U J1.S J1.P J1.M J1.K J1.H J1.E J1.C J1.A
  Bottom 0.813: U$2.DC2 51.94,8.26 v51.94,16.51 51.94,17.78 40.51,25.4 40.51,48.26 | C18.- 40.51,48.26 | 40.51,69.85 46.86,69.85 C17.- 46.86,91.44 | 40.51,69.85 40.51,48.26 | 27.81,69.85 EC1.7 | 27.81,69.85 40.51,69.85 | 46.86,91.44 C29.2 | 27.81,69.85 18.92,69.85 7.49,81.28 7.49,142.24 | 7.49,157.48 7.49,187.96 11.3,191.77 45.59,191.77 | 7.49,157.48 7.49,149.86 | 7.49,149.86 7.49,142.24 | J1.A J1.C J1.E J1.H J1.K J1.M J1.P J1.S J1.U J1.W 7.49,157.48 | 258.95,144.78 258.95,166.37 R18.1 R20.1 R22.1 R24.1 250.06,187.96 246.25,191.77 225.93,191.77 | C23.- 258.95,144.78 | U$2.AC1 255.14,8.26 v255.14,17.78 258.95,21.59 258.95,48.26 | 258.95,48.26 C26.- | C25.- 258.95,81.28 | 258.95,81.28 258.95,48.26 | C24.- 258.95,113.03 | 258.95,113.03 258.95,81.28 | 258.95,144.78 258.95,113.03 | 7.49,142.24 J1.KK | 7.49,149.86 J1.CC J1.FF | 48.13,146.05 C4.2 C3.2 C2.2 C1.2 48.13,171.45 49.4,172.72 49.4,176.53 45.59,180.34 45.59,191.77 | 65.91,191.77 82.42,191.77 | 82.42,191.77 119.25,191.77 | 119.25,191.77 154.81,191.77 | 154.81,191.77 225.93,191.77 | 65.91,191.77 50.67,191.77 | 50.67,191.77 45.59,191.77 | 50.67,191.77 C27.1 | C28.1 65.91,191.77 | EC2.8 ED2.1 | U$2.BC1 185.29,8.26 v185.29,17.78 185.29,50.8 | C45.2 185.29,50.8 | 185.29,50.8 184.02,52.07 184.02,81.28 C44.2 | EA2.7 C15.- 48.13,146.05 | 48.13,146.05 C5.2 C6.2 C7.2 C8.2 C9.2 C10.2 50.67,113.03 | v129.41,78.74 ED4.1 | U$2.CC2 121.79,8.26 v121.79,17.78 115.44,24.13 C37.2 | EB4.7 EC4.1 | EC3.8 ED3.1 | C33.2 81.15,53.34 82.42,54.61 82.42,83.82 | 82.42,83.82 C32.2 | 82.42,110.49 82.42,83.82 | 82.42,110.49 EB3.8 | 82.42,115.57 C31.2 | 82.42,115.57 82.42,110.49 | 82.42,148.59 C30.2 | 82.42,148.59 82.42,115.57
  Bottom 0.813: 82.42,191.77 82.42,148.59 | 119.25,148.59 119.25,120.65 C35.2 115.44,93.98 112.9,92.71 112.9,83.82 C36.2 | 119.25,191.77 119.25,148.59 | C39.2 153.54,118.11 154.81,119.38 154.81,149.86 | 154.81,149.86 C38.2 | 119.25,148.59 C34.2 | 154.81,191.77 154.81,149.86 | 46.86,91.44 50.67,91.44 50.67,113.03 | 50.67,113.03 C16.- EB2.7 | C41.2 152.27,53.34 153.54,54.61 153.54,58.42 151,60.96 C40.2 | C42.2 190.37,146.05 190.37,121.92 C43.2 | 225.93,147.32 C46.2 | 225.93,147.32 225.93,116.84 | 225.93,116.84 C47.2 | 225.93,116.84 225.93,85.09 | 225.93,85.09 C48.2 | C49.2 228.47,55.88 228.47,64.77 225.93,67.31 225.93,85.09 | 225.93,191.77 225.93,147.32
  pour Top: 48.13,48.26 46.86,48.26 45.59,46.99 45.59,41.91 101.47,41.91 104.01,44.45 253.87,44.45 253.87,49.53 252.6,49.53 252.6,46.99 101.47,46.99 98.93,44.45 48.13,44.45
  pour Top: 48.13,81.28 45.59,81.28 45.59,74.93 105.28,74.93 105.28,77.47 253.87,77.47 253.87,82.55 252.6,82.55 252.6,80.01 102.74,80.01 102.74,77.47 48.13,77.47
  pour Top: 102.74,109.22 95.12,109.22 92.58,110.49 34.16,110.49 31.62,107.95 21.46,107.95 8.76,121.92 8.76,157.48 13.84,157.48 13.84,181.61 6.22,181.61 6.22,123.19 7.49,121.92 20.19,106.68 34.16,106.68 35.43,107.95 105.28,107.95 105.28,110.49 178.94,110.49 185.29,116.84 187.83,116.84 194.18,110.49 253.87,110.49 253.87,115.57 252.6,115.57 252.6,111.76 195.45,111.76 189.1,118.11 184.02,118.11 177.67,111.76 102.74,111.76
  pour Bottom: 51.94,16.51 50.67,16.51 36.7,26.67 36.7,68.58 18.92,68.58 4.95,82.55 4.95,189.23 10.03,194.31 246.25,194.31 264.03,176.53 264.03,24.13 255.14,16.51 255.14,19.05 257.68,21.59 257.68,46.99 252.6,46.99 252.6,49.53 257.68,49.53 257.68,165.1 250.06,165.1 250.06,180.34 244.98,185.42 81.15,185.42 81.15,189.23 12.57,189.23 11.3,186.69 12.57,184.15 13.84,184.15 13.84,157.48 11.3,157.48 11.3,83.82 20.19,74.93 45.59,74.93 45.59,90.17 40.51,90.17 40.51,92.71 49.4,92.71 49.4,100.33 46.86,102.87 46.86,114.3 57.02,114.3 57.02,102.87 54.48,100.33 54.48,90.17 48.13,85.09 48.13,68.58 43.05,68.58 43.05,24.13 51.94,17.78
INITIALIZE  (via drill 0.81)
  Top 0.406: U$2.CR1 86.23,8.26 v86.23,19.05
  Bottom 0.406: ED2.12 ED2.11 63.37,54.61 63.37,41.91 79.88,17.78 82.42,16.51 84.96,16.51 86.23,17.78 v86.23,19.05
IOT  (via drill 0.81)
  Top 0.406: ED4.3 133.22,59.69 147.19,59.69 v148.46,60.96 | 153.54,90.17 v148.46,86.36 | 153.54,90.17 156.08,90.17 162.43,87.63 205.61,87.63 EC6.11 | 153.54,90.17 153.54,91.44 151,93.98 149.73,93.98 140.84,87.63 121.79,87.63 117.98,85.09 109.09,85.09 104.01,82.55 93.85,82.55 EC3.6 91.31,83.82 86.23,81.28 74.8,81.28 69.72,82.55 59.56,82.55 58.29,83.82 EC2.6
  Bottom 0.406: v148.46,86.36 v148.46,60.96 | EC6.11 EC6.12
IOT011  (via drill 0.81)
  Top 0.406: v194.18,109.22 184.02,109.22 181.48,107.95 v111.63,107.95 | v111.63,133.35 v70.99,133.35
  Bottom 0.406: v194.18,109.22 204.34,97.79 204.34,86.36 201.8,83.82 EC6.6 | EB2.8 67.18,113.03 70.99,119.38 v70.99,133.35 | v111.63,107.95 v111.63,133.35
LSTROBE  (via drill 0.81)
  Top 0.406: v105.28,119.38 145.92,119.38 147.19,120.65 v159.89,120.65
  Bottom 0.406: v159.89,120.65 158.62,116.84 158.62,104.14 161.16,90.17 162.43,87.63 EC5.5 167.51,85.09 167.51,76.2 164.97,69.85 ED5.1 | EB3.9 101.47,110.49 105.28,114.3 v105.28,119.38 105.28,137.16 101.47,143.51 EA3.9
N$1  (via drill 0.81)
  Top 0.406: v210.69,68.58 v234.82,68.58
  Bottom 0.406: v234.82,68.58 ED7.1 | EB5.3 166.24,123.19 170.05,118.11 170.05,113.03 171.32,110.49 175.13,109.22 177.67,109.22 182.75,113.03 194.18,113.03 197.99,110.49 210.69,97.79 v210.69,68.58
N$18  (via drill 0.81)
  Top 0.406: EB4.2 131.95,127 176.4,127 181.48,128.27 191.64,128.27 194.18,127 v219.58,127 | v224.66,62.23 238.63,62.23 ED7.12
  Bottom 0.406: v219.58,127 219.58,85.09 220.85,81.28 220.85,67.31 v224.66,62.23 | EB4.2 131.95,128.27 131.95,140.97 133.22,144.78 133.22,147.32 | 133.22,156.21 EA4.2 | 133.22,147.32 EA4.6 | 133.22,147.32 EA4.9 | 133.22,147.32 133.22,156.21 | 133.22,156.21 EA4.12
N$19  (via drill 0.81)
  Top 0.406: EA2.6 64.64,143.51 v74.8,143.51 | EB3.4 82.42,120.65 81.15,119.38 78.61,119.38 v74.8,123.19
  Bottom 0.406: v74.8,123.19 v74.8,143.51
N$20
  Bottom 0.406: ED7.10 241.17,54.61 241.17,59.69 ED7.13
N$22  (via drill 0.81)
  Top 0.406: ED7.5 233.55,54.61 229.74,54.61 228.47,53.34 219.58,53.34 210.69,59.69 195.45,59.69 189.1,53.34 184.02,53.34 175.13,60.96 ED5.13 170.05,59.69 v158.62,59.69 | EC4.13 147.19,93.98 148.46,95.25 151,95.25 153.54,92.71 v157.35,92.71
  Bottom 0.406: v158.62,59.69 158.62,82.55 157.35,86.36 v157.35,92.71
N$23  (via drill 0.81)
  Top 0.406: ED7.3 232.28,58.42 224.66,54.61 219.58,54.61 215.77,62.23 195.45,62.23 187.83,54.61 184.02,54.61 176.4,62.23 v154.81,62.23 | EC3.5 96.39,90.17 105.28,90.17 111.63,87.63 116.71,87.63 125.6,95.25 135.76,95.25 EC4.14 139.57,95.25 147.19,95.25 148.46,96.52 151,96.52 152.27,95.25 v154.81,95.25
  Bottom 0.406: v154.81,62.23 v154.81,95.25
N$24  (via drill 0.81)
  Top 0.406: v247.52,106.68 v242.44,106.68
  Bottom 0.406: v247.52,106.68 247.52,95.25 251.33,91.44 251.33,83.82 248.79,80.01 248.79,71.12 239.9,64.77 ED7.2 | EB7.13 239.9,123.19 239.9,110.49 v242.44,106.68
N$25  (via drill 0.81)
  Top 0.406: v97.66,39.37 129.41,39.37 130.68,40.64 170.05,40.64 171.32,39.37 v238.63,39.37
  Bottom 0.406: ED7.6 236.09,50.8 238.63,48.26 v238.63,39.37 | v97.66,39.37 97.66,63.5 100.2,67.31 100.2,73.66 97.66,78.74 97.66,86.36 95.12,88.9 EC3.4
N$26  (via drill 0.81)
  Top 0.406: v228.47,107.95 184.02,107.95 181.48,106.68 105.28,106.68 102.74,105.41 27.81,105.41 v24,102.87 | J1.EE 10.03,143.51 10.03,123.19 21.46,110.49 v24,109.22
  Bottom 0.406: R24.2 R23.1 232.28,175.26 232.28,161.29 EA7.2 227.2,151.13 227.2,111.76 228.47,109.22 v228.47,107.95 | v24,102.87 v24,109.22
N$29  (via drill 0.81)
  Top 0.406: ED6.8 228.47,48.26 233.55,49.53 243.71,49.53 247.52,53.34 v250.06,53.34
  Bottom 0.406: EB7.11 246.25,120.65 250.06,116.84 250.06,95.25 252.6,91.44 252.6,83.82 250.06,80.01 v250.06,53.34
N$33  (via drill 0.81)
  Top 0.406: v231.01,106.68 184.02,106.68 181.48,105.41 105.28,105.41 102.74,104.14 v40.51,104.14 | v43.05,139.7 40.51,140.97 22.73,140.97 20.19,143.51 20.19,146.05 J1.DD
  Bottom 0.406: R17.1 R18.2 237.36,158.75 EA7.3 228.47,149.86 228.47,115.57 231.01,107.95 v231.01,106.68 | v40.51,104.14 37.97,109.22 37.97,130.81 43.05,135.89 v43.05,139.7
N$34
  Bottom 0.406: ED6.9 210.69,50.8 213.23,53.34 213.23,62.23 215.77,66.04 215.77,77.47 214.5,81.28 214.5,105.41 209.42,113.03 EB6.8
N$38  (via drill 0.81)
  Top 0.406: ED6.3 196.72,58.42 v192.91,54.61
  Bottom 0.406: EC5.10 187.83,86.36 190.37,83.82 190.37,59.69 v192.91,54.61
N$39  (via drill 0.81)
  Top 0.406: ED6.6 203.07,49.53 213.23,49.53 218.31,52.07 229.74,52.07 v232.28,53.34
  Bottom 0.406: v232.28,53.34 232.28,68.58 234.82,72.39 234.82,76.2 232.28,80.01 232.28,87.63 233.55,88.9 EC7.4
N$40  (via drill 0.81)
  Top 0.406: EC5.1 167.51,95.25 178.94,95.25 191.64,93.98 v197.99,92.71
  Bottom 0.406: ED6.11 206.88,55.88 205.61,57.15 205.61,64.77 197.99,72.39 196.72,74.93 196.72,86.36 197.99,88.9 v197.99,92.71
N$41  (via drill 0.81)
  Top 0.406: v233.55,105.41 184.02,105.41 181.48,104.14 105.28,104.14 102.74,102.87 29.08,102.87 v26.54,101.6 | J1.HH 11.3,142.24 11.3,124.46 22.73,111.76 v26.54,110.49
  Bottom 0.406: R19.1 R20.2 238.63,168.91 238.63,154.94 EA7.5 229.74,146.05 229.74,115.57 233.55,106.68 v233.55,105.41 | v26.54,101.6 v26.54,110.49
N$43  (via drill 0.81)
  Top 0.406: v236.09,104.14 184.02,104.14 181.48,102.87 105.28,102.87 102.74,101.6 v35.43,101.6 | v40.51,137.16 37.97,139.7 22.73,139.7 17.65,144.78 J1.JJ
  Bottom 0.406: R21.1 R22.2 239.9,171.45 239.9,153.67 EA7.6 231.01,144.78 231.01,115.57 236.09,105.41 v236.09,104.14 | v35.43,101.6 36.7,106.68 36.7,132.08 v40.51,137.16
N$44
  Top 0.406: EB2.2 58.29,127 68.45,127 77.34,118.11 81.15,118.11 82.42,119.38 97.66,119.38 EB3.13
N$45
  Top 0.406: EA2.12 81.15,156.21 90.04,152.4 97.66,152.4 EA3.13
N$48
  Bottom 0.406: C12.2 215.77,144.78 210.69,154.94 EA6.14
N$49
  Bottom 0.406: EB7.6 232.28,118.11 232.28,143.51 EA7.7
N$51
  Top 0.406: EA2.10 84.96,151.13 90.04,149.86 97.66,149.86 EA3.12
N$52
  Bottom 0.406: C14.1 R12.2 EA5.15
N$53  (via drill 0.81)
  Top 0.406: v167.51,137.16 173.86,137.16 175.13,138.43 v196.72,138.43
  Bottom 0.406: EA5.3 167.51,153.67 v167.51,137.16 | EB6.5 196.72,121.92 v196.72,138.43
N$54
  Top 0.406: EA3.6 95.12,147.32 107.82,147.32 111.63,149.86 120.52,149.86 126.87,146.05 134.49,146.05 EA4.8
N$57  (via drill 0.81)
  Top 0.406: EC1.11 31.62,82.55 31.62,64.77 21.46,54.61 21.46,46.99 27.81,40.64 129.41,40.64 130.68,41.91 v167.51,41.91
  Bottom 0.406: v167.51,41.91 167.51,54.61 166.24,55.88 ED5.4
N$58
  Bottom 0.406: ED5.6 163.7,50.8 162.43,52.07 162.43,59.69 163.7,60.96 ED5.2
N$59  (via drill 0.81)
  Top 0.406: v176.4,137.16 v205.61,137.16
  Bottom 0.406: EB5.13 171.32,127 171.32,132.08 v176.4,137.16 | EA6.13 205.61,151.13 v205.61,137.16
N$61  (via drill 0.81)
  Top 0.406: v58.29,31.75 60.83,30.48 129.41,30.48 130.68,31.75 v177.67,31.75
  Bottom 0.406: ED5.11 175.13,54.61 177.67,50.8 v177.67,31.75 | EC2.4 53.21,85.09 53.21,38.1 v58.29,31.75
N$62
  Top 0.406: ED4.4 124.33,55.88 115.44,63.5 ED3.14
N$64
  Top 0.406: ED4.10 133.22,49.53 124.33,49.53 116.71,55.88 102.74,55.88 101.47,57.15 96.39,57.15 ED3.3
  Bottom 0.406: ED4.10 ED4.11 ED4.12
N$65  (via drill 0.81)
  Top 0.406: v159.89,133.35 v208.15,133.35
  Bottom 0.406: v159.89,133.35 157.35,127 157.35,104.14 159.89,91.44 159.89,88.9 161.16,86.36 163.7,83.82 EC5.6 | v208.15,133.35 EA6.9
N$66
  Bottom 0.406: EC6.2 197.99,96.52 197.99,100.33 R16.2
N$67
  Top 0.406: ED3.10 ED3.6 | ED2.4 ED2.10 R15.2 78.61,60.96 86.23,60.96 ED3.4 ED3.10 | ED3.10 102.74,54.61 116.71,54.61 125.6,46.99 133.22,46.99 ED4.9
  Bottom 0.406: ED4.9 135.76,50.8 134.49,52.07 134.49,82.55 135.76,83.82 EC4.9 138.3,85.09 138.3,87.63 EC4.11 | ED3.10 98.93,54.61 98.93,57.15 ED3.12 | ED2.6 58.29,50.8 59.56,52.07 59.56,54.61 58.29,55.88 ED2.4 | R15.2 73.53,58.42 73.53,71.12 70.99,78.74 70.99,101.6 59.56,115.57 EB2.6
N$68
  Top 0.406: ED4.6 124.33,50.8 116.71,57.15 106.55,57.15 104.01,59.69 96.39,59.69 ED3.2
N$69
  Top 0.406: ED3.13 115.44,60.96 124.33,53.34 ED4.5
N$70  (via drill 0.81)
  Top 0.406: v45.59,173.99 RP3.5 | v211.96,135.89 v45.59,135.89
  Bottom 0.406: R10.2 C10.1 44.32,113.03 45.59,114.3 v45.59,135.89 v45.59,173.99 | EA6.10 211.96,143.51 v211.96,135.89
N$71
  Top 0.406: C11.1 197.99,144.78 201.8,144.78 203.07,146.05 203.07,147.32 201.8,148.59 EA6.6
N$72
  Top 0.406: EA3.4 90.04,153.67 74.8,160.02 59.56,160.02 EA2.2
N$73
  Top 0.406: EA3.3 95.12,157.48 120.52,157.48 126.87,154.94 EA4.3
N$75  (via drill 0.81)
  Top 0.406: v133.22,137.16 v55.75,137.16
  Bottom 0.406: EB2.5 55.75,119.38 v55.75,137.16 | v133.22,137.16 133.22,97.79 131.95,95.25 130.68,93.98 EC4.2
N$76
  Top 0.406: EA3.14 120.52,156.21 126.87,153.67 134.49,153.67 EA4.11
N$77
  Top 0.406: R13.2 C11.2 EA6.7
N$82
  Top 0.406: EC2.1 58.29,96.52 59.56,95.25 70.99,95.25 78.61,87.63 82.42,87.63 91.31,96.52 EC3.1
  Bottom 0.406: EC2.1 58.29,96.52 63.37,91.44 63.37,64.77 ED2.14
N$87  (via drill 0.81)
  Top 0.406: v60.83,29.21 129.41,29.21 130.68,30.48 200.53,30.48 210.69,36.83 v241.17,36.83
  Bottom 0.406: EC2.5 54.48,83.82 54.48,41.91 60.83,33.02 v60.83,29.21 | ED7.4 236.09,55.88 241.17,50.8 v241.17,36.83
N$91
  Top 0.406: EC2.2 58.29,93.98 59.56,92.71 70.99,92.71 77.34,86.36 83.69,86.36 91.31,93.98 EC3.2
  Bottom 0.406: EC2.2 58.29,93.98 62.1,90.17 62.1,62.23 58.29,58.42 ED2.3
N$92
  Top 0.406: EC2.3 58.29,91.44 59.56,90.17 68.45,90.17 76.07,85.09 84.96,85.09 91.31,91.44 EC3.3
  Bottom 0.406: EC2.3 58.29,91.44 60.83,88.9 60.83,63.5 58.29,60.96 ED2.2
N$106  (via drill 0.81)
  Top 0.406: v244.98,95.25 233.55,95.25 231.01,92.71 231.01,87.63 229.74,86.36 219.58,86.36 211.96,83.82 EC6.9 EC6.5
  Bottom 0.406: EB7.9 243.71,115.57 244.98,114.3 v244.98,95.25
N$107
  Top 0.406: EC6.8 205.61,82.55 196.72,82.55 189.1,86.36 184.02,86.36 177.67,83.82 EC5.9
N$130  (via drill 0.81)
  Top 0.406: v161.16,101.6 181.48,101.6 184.02,102.87 v239.9,102.87
  Bottom 0.406: v161.16,101.6 161.16,116.84 162.43,119.38 162.43,127 163.7,128.27 EB5.1 | EC7.6 236.09,83.82 238.63,86.36 238.63,96.52 239.9,99.06 v239.9,102.87
N$182
  Top 0.406: EB5.8 177.67,114.3 182.75,119.38 189.1,119.38 197.99,114.3 201.8,114.3 209.42,114.3 210.69,115.57 210.69,119.38 209.42,120.65 EB6.11
N$188
  Top 0.406: EB6.9 205.61,116.84 197.99,116.84 189.1,124.46 182.75,124.46 173.86,115.57 EB5.9
N$198
  Top 0.406: EB6.3 195.45,123.19 190.37,125.73 181.48,125.73 173.86,120.65 EB5.11
N$204
  Top 0.406: EB6.6 197.99,115.57 189.1,120.65 182.75,120.65 173.86,114.3 171.32,114.3 170.05,115.57 170.05,120.65 EB5.12
N$211
  Bottom 0.406: EA5.13 168.78,149.86 168.78,121.92 171.32,118.11 EB5.10
N$222
  Top 0.406: EB3.14 123.06,123.19 129.41,121.92 134.49,121.92 EB4.11
N$224
  Top 0.406: EB3.6 95.12,114.3 101.47,114.3 112.9,116.84 117.98,116.84 128.14,114.3 134.49,114.3 EB4.8
N$226
  Top 0.406: EB3.11 107.82,118.11 EB4.5
N$227
  Top 0.406: EB3.3 95.12,124.46 123.06,124.46 EB4.3
N$232
  Top 0.406: EB3.5 82.42,118.11 81.15,116.84 76.07,116.84 69.72,123.19 EB2.12
N$239
  Top 0.406: EB3.12 97.66,116.84 88.77,116.84 83.69,114.3 76.07,114.3 68.45,121.92 59.56,121.92 EB2.4
N$247
  Top 0.406: C7.1 45.59,121.92 53.21,121.92 55.75,124.46 62.1,124.46 EB2.13
  Bottom 0.406: EB2.13 67.18,125.73 68.45,127 68.45,129.54 67.18,133.35 67.18,137.16 70.99,144.78 70.99,154.94 72.26,156.21 RP4.8 | R7.2 C7.1
N$250
  Top 0.406: EB2.3 51.94,118.11 45.59,118.11 C8.1
  Bottom 0.406: EB2.3 58.29,123.19 60.83,125.73 60.83,133.35 62.1,135.89 62.1,176.53 59.56,179.07 RP3.3 | R8.2 C8.1
N$251
  Top 0.406: C6.1 45.59,125.73 54.48,125.73 EB2.1
  Bottom 0.406: EB2.1 58.29,128.27 59.56,129.54 59.56,133.35 60.83,137.16 60.83,173.99 58.29,176.53 RP3.4 | R6.2 C6.1
N$253
  Top 0.406: EB2.11 62.1,119.38 55.75,119.38 50.67,114.3 45.59,114.3 C9.1
  Bottom 0.406: EB2.11 62.1,123.19 62.1,130.81 63.37,134.62 63.37,177.8 59.56,181.61 RP3.2 | R9.2 C9.1
N$268
  Bottom 0.406: C12.1 R11.2 EA6.15
N$276
  Top 0.406: C13.2 EA5.6
N$277
  Bottom 0.406: EA5.7 163.7,146.05 161.16,148.59 R14.2 C13.1
N$283
  Top 0.406: EA5.14 180.21,148.59 C14.2
N$294
  Top 0.406: EA4.5 126.87,149.86 123.06,151.13 110.36,151.13 105.28,148.59 EA3.11
N$300
  Top 0.406: EA3.5 90.04,151.13 84.96,152.4 78.61,152.4 73.53,154.94 59.56,154.94 EA2.4
N$313
  Top 0.406: EA2.13 62.1,157.48 55.75,157.48 50.67,153.67 45.59,153.67 C2.1
  Bottom 0.406: EA2.13 67.18,158.75 68.45,160.02 68.45,168.91 70.99,171.45 RP4.6 | R2.2 C2.1
N$315
  Top 0.406: C5.1 45.59,142.24 51.94,142.24 54.48,144.78 54.48,148.59 EA2.5
  Bottom 0.406: EA2.5 55.75,151.13 51.94,153.67 50.67,154.94 50.67,166.37 55.75,171.45 RP3.6 | R5.2 C5.1
N$316
  Top 0.406: C3.1 45.59,149.86 49.4,149.86 EA2.3
  Bottom 0.406: RP3.7 55.75,167.64 55.75,157.48 EA2.3 | R3.2 C3.1
N$317
  Top 0.406: C1.1 45.59,157.48 51.94,157.48 EA2.1
  Bottom 0.406: EA2.1 RP3.8 | R1.2 C1.1
N$319
  Top 0.406: C4.1 45.59,146.05 48.13,146.05 55.75,152.4 62.1,152.4 EA2.11
  Bottom 0.406: EA2.11 68.45,153.67 69.72,156.21 69.72,167.64 70.99,168.91 RP4.7 | R4.2 C4.1
N$328
  Bottom 0.406: P1.E P1.S R14.1
N$330
  Bottom 0.406: P2.E P2.S R12.1
N$334
  Bottom 0.406: P3.E P3.S R11.1
PTERR  (via drill 0.81)
  Top 0.406: v21.46,138.43 20.19,137.16 20.19,116.84 RP2.8
  Bottom 0.406: J1.R 21.46,160.02 v21.46,138.43 | RP2.8 R10.1
PTR04
  Bottom 0.406: J1.N 22.73,165.1 26.54,162.56 R1.1 RP1.2
PTR05
  Bottom 0.406: RP1.5 R3.1 30.35,154.94 30.35,165.1 27.81,167.64 17.65,172.72 J1.J
PTR06
  Bottom 0.406: RP1.6 R4.1 30.35,149.86 31.62,152.4 31.62,167.64 27.81,170.18 17.65,175.26 J1.F
PTR07
  Bottom 0.406: RP1.3 R2.1 29.08,157.48 29.08,163.83 22.73,167.64 J1.L
PTR08
  Bottom 0.406: RP1.8 R5.1 29.08,144.78 32.89,147.32 32.89,168.91 30.35,171.45 17.65,177.8 J1.D
PTR09
  Bottom 0.406: R7.1 RP2.4 20.19,127 20.19,158.75 J1.T
PTR10
  Bottom 0.406: R8.1 RP2.5 21.46,121.92 18.92,124.46 18.92,157.48 J1.V
PTR11
  Bottom 0.406: J1.B 17.65,180.34 32.89,172.72 34.16,168.91 34.16,146.05 29.08,139.7 27.81,137.16 R6.1 RP2.2
PTSTROBE
  Bottom 0.406: R9.1 RP2.7 21.46,116.84 17.65,123.19 17.65,156.21 J1.X
RUN  (via drill 0.81)
  Top 0.406: v190.37,149.86 194.18,153.67 195.45,153.67 EA6.5 204.34,147.32 210.69,147.32 215.77,149.86 222.12,149.86 232.28,161.29 EA7.1
  Bottom 0.406: EA5.9 178.94,149.86 v190.37,149.86
STOP
  Top 0.406: EA6.3 EA6.12
  Bottom 0.406: EA6.3 203.07,153.67 203.07,140.97 201.8,137.16 201.8,132.08 | 201.8,132.08 201.8,129.54 EB6.1 | 201.8,132.08 208.15,132.08 210.69,129.54 210.69,120.65 EB6.10
STOPPED
  Bottom 0.406: ED6.10 210.69,53.34 211.96,54.61 211.96,58.42 | 211.96,58.42 ED6.12 | 211.96,58.42 211.96,63.5 214.5,67.31 214.5,77.47 213.23,80.01 213.23,97.79 208.15,102.87 195.45,114.3 192.91,119.38 192.91,149.86 191.64,151.13 EA5.12
TP3  (via drill 0.81)
  Top 0.406: v119.25,83.82 123.06,86.36 EC4.5
  Bottom 0.406: U$2.CH2 109.09,8.26 109.09,15.24 111.63,17.78 111.63,73.66 v119.25,83.82
  Bottom 0.813: EC4.5 EC4.4
VCC  (via drill 0.81)
  Top 0.813: C18.+ 48.13,66.04 R15.1 v79.88,66.04 v115.44,66.04 145.92,66.04 | 145.92,66.04 C22.+ | 151,66.04 145.92,66.04 | 151,66.04 C41.1 ED4.8 | 172.59,66.04 ED5.14 | 172.59,66.04 151,66.04 | 208.15,66.04 ED6.14 | 208.15,66.04 186.56,66.04 | 186.56,66.04 172.59,66.04 | 186.56,66.04 C45.1 | 222.12,66.04 C49.1 | 222.12,66.04 208.15,66.04 | 253.87,66.04 C26.+ | 253.87,66.04 247.52,66.04 | 247.52,66.04 242.44,66.04 | 242.44,66.04 222.12,66.04 | 242.44,66.04 ED7.14 | 247.52,66.04 C53.1 | 261.49,64.77 261.49,66.04 253.87,66.04 | C17.+ 46.86,99.06 64.64,99.06 | 253.87,99.06 261.49,99.06 | 247.52,99.06 253.87,99.06 | 222.12,99.06 242.44,99.06 | 242.44,99.06 247.52,99.06 | 172.59,99.06 R16.1 208.15,99.06 | 208.15,99.06 222.12,99.06 | 172.59,99.06 145.92,99.06 | 145.92,99.06 115.44,99.06 | 115.44,99.06 100.2,99.06 | 100.2,99.06 79.88,99.06 | 79.88,99.06 64.64,99.06 | 261.49,99.06 261.49,64.77 | 261.49,64.77 v261.49,17.78 | 247.52,99.06 C52.1 | 253.87,99.06 C25.+ | 222.12,99.06 C48.1 | EC5.14 172.59,99.06 | 145.92,99.06 C21.+ | 115.44,99.06 C36.1 | 100.2,99.06 EC3.16 | 79.88,99.06 C32.1 | 64.64,99.06 EC2.16 | RP2.1 53.21,132.08 53.21,130.81 | 53.21,130.81 C16.+ | 64.64,130.81 EB2.14 | 64.64,130.81 53.21,130.81 | 100.2,130.81 EB3.16 | 100.2,130.81 92.58,130.81 | 92.58,130.81 79.88,130.81 | 79.88,130.81 64.64,130.81 | 100.2,130.81 v115.44,130.81 137.03,130.81 | 137.03,130.81 EB4.14 | 145.92,130.81 C20.+ | 145.92,130.81 137.03,130.81 | 172.59,130.81 EB5.14 | 172.59,130.81 145.92,130.81 | 208.15,130.81 EB6.14 | 208.15,130.81 172.59,130.81 | 222.12,130.81 C47.1 | 222.12,130.81 208.15,130.81 | 242.44,130.81 EB7.14 | 242.44,130.81 222.12,130.81 | 247.52,130.81 247.52,123.19 | 247.52,123.19 C51.1 EB7.10
  Top 0.813: 247.52,130.81 242.44,130.81 | 253.87,130.81 C24.+ | 253.87,130.81 247.52,130.81 | 247.52,123.19 EB7.12 | EA3.16 100.2,163.83 | 100.2,163.83 92.58,163.83 | 92.58,163.83 79.88,163.83 | 79.88,163.83 64.64,163.83 | 64.64,163.83 EA2.14 | 64.64,163.83 53.21,163.83 | 53.21,163.83 24,163.83 RP1.1 | 53.21,163.83 C15.+ | 79.88,163.83 v79.88,161.29 | 137.03,163.83 EA4.14 | 137.03,163.83 100.2,163.83 | 145.92,163.83 C19.+ | 145.92,163.83 137.03,163.83 | 151,163.83 C38.1 | 151,163.83 145.92,163.83 | 172.59,163.83 EA5.16 170.05,158.75 | 172.59,163.83 167.51,163.83 | 167.51,163.83 151,163.83 | 208.15,163.83 EA6.16 | 186.56,163.83 R13.1 203.07,163.83 | 186.56,163.83 185.29,163.83 | 185.29,163.83 172.59,163.83 | 208.15,163.83 203.07,163.83 | 222.12,163.83 C46.1 214.5,152.4 EA6.11 | 222.12,163.83 208.15,163.83 | 222.12,163.83 R17.2 R19.2 R21.2 R23.2 | 242.44,163.83 EA7.16 | 242.44,163.83 222.12,163.83 | 253.87,163.83 C23.+ 247.52,160.02 C50.1 | 253.87,163.83 242.44,163.83 | 79.88,130.81 C31.1 | 261.49,99.06 261.49,130.81 | 261.49,130.81 253.87,130.81 | 253.87,163.83 261.49,163.83 261.49,130.81 | 208.15,99.06 EC6.14 | C40.1 EC4.8 | ED2.8 69.72,48.26 C33.1 92.58,45.72 97.66,45.72 ED3.8 | 186.56,163.83 C42.1 | 242.44,99.06 EC7.14 | 203.07,163.83 P3.A | 185.29,163.83 P2.A | 167.51,163.83 P1.A | EC5.4 EC5.11 | 92.58,130.81 EB3.1 | 170.05,158.75 170.05,151.13 EA5.11 | EA5.11 EA5.10 EA5.11 | 170.05,158.75 EA5.2 | 92.58,163.83 EA3.1 | EA7.4 239.9,158.75 EA7.15
  Bottom 0.813: C17.+ C29.1 EC1.14 31.62,93.98 | U$2.AA2 261.49,8.26 v261.49,17.78 | 31.62,93.98 EC1.1 EC1.2 | 31.62,83.82 EC1.10 EC1.9 | 31.62,83.82 EC1.5 EC1.4 | 31.62,93.98 31.62,83.82 | v79.88,66.04 C33.1 | U$2.BA2 191.64,8.26 191.64,15.24 190.37,16.51 190.37,54.61 189.1,55.88 C45.1 | C52.1 EC7.12 EC7.13 | C44.1 EC5.11 EC5.12 175.13,91.44 175.13,96.52 EC5.14 EC5.2 | C21.+ C40.1 | C35.1 v115.44,130.81 115.44,135.89 109.09,140.97 109.09,153.67 | C20.+ C39.1 | EB5.14 175.13,128.27 185.29,123.19 C43.1 | v79.88,161.29 C30.1 | 109.09,153.67 C34.1 | EA3.16 109.09,161.29 109.09,153.67 | v115.44,66.04 C37.1 119.25,54.61 119.25,26.67 128.14,17.78 128.14,8.26 U$2.CA2 | EA2.9 65.91,148.59 68.45,146.05 68.45,143.51 64.64,134.62 EB2.14 | EA7.9 244.98,146.05 244.98,151.13 C50.1 EA7.15 | EB6.14 EB6.4
  pour Top: 261.49,17.78 261.49,16.51 258.95,16.51 255.14,20.32 255.14,165.1 261.49,165.1
  pour Top: 255.14,67.31 45.59,67.31 45.59,64.77 255.14,64.77
  pour Top: 255.14,100.33 45.59,100.33 45.59,97.79 255.14,97.79
  pour Top: 255.14,132.08 51.94,132.08 51.94,129.54 255.14,129.54
  pour Top: 53.21,130.81 53.21,133.35 22.73,133.35 22.73,130.81
  pour Top: 255.14,165.1 25.27,165.1 22.73,162.56 255.14,162.56
  pour Bottom: 173.86,88.9 186.56,88.9 186.56,91.44 177.67,91.44 177.67,96.52 173.86,96.52

## Text on the board
Bottom: PART NO. | 005744-001 | REV. | c
tPlace: Needs tSilk
200bmp: C:/Users/Vince/Documents/websvn/trunk/Eagle/projects/DEC/Charmille_Andrews/005743-001backfb.bmp